# Altium schematic sheet РЕЛЕ.SchDoc
size A4; Organization: Altium Limited; Address1: L3, 12a Rodborough Rd; Address2: Frenchs Forest; Address3: NSW; Address4: Australia 2086; SheetNumber: 5; SheetTotal: 5
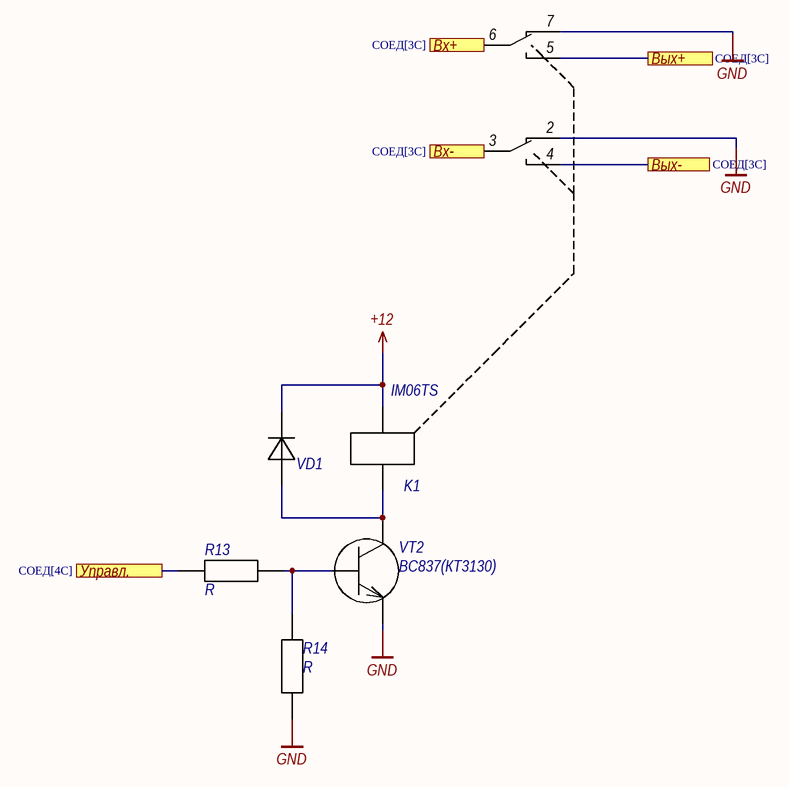
[diagram p0: РЕЛЕ.SchDoc]

## Parts
K1  IM06TS  [IM06TS]
R13  R  [R]
R14  R  [R]
VD1  SS14  [SS14]  (value not drawn)
VT2  BC837(КТ3130)  [BC847(IRLML6402)]

## Ports
Вх+ (see СОЕД[3C]), Вх- (see СОЕД[3C]), Вых+ (see СОЕД[3C]), Вых- (see СОЕД[3C]), Управл. (see СОЕД[4C])

## Nets
+12: K1.1 VD1.1
GND: K1.2 K1.7 R14.1 VT2.2
Вх+: K1.6 ; port Вх+
Вх-: K1.3 ; port Вх-
Вых+: K1.5 ; port Вых+
Вых-: K1.4 ; port Вых-
Управл.: R13.1 ; port Управл.
NetK1_8: K1.8 VD1.2 VT2.3
NetR13_2: R13.2 R14.2 VT2.1

## Notes on the sheet
- Title
- Size:
- Date:
- A4
- Number:
- Time:
- Revision:
- Sheet
- of
- File:

## Library data of the parts
VT2 = BC837(КТ3130): Транзистор